# EAGLE design perfboard-tiny45usb2 (EAGLE 5.06)
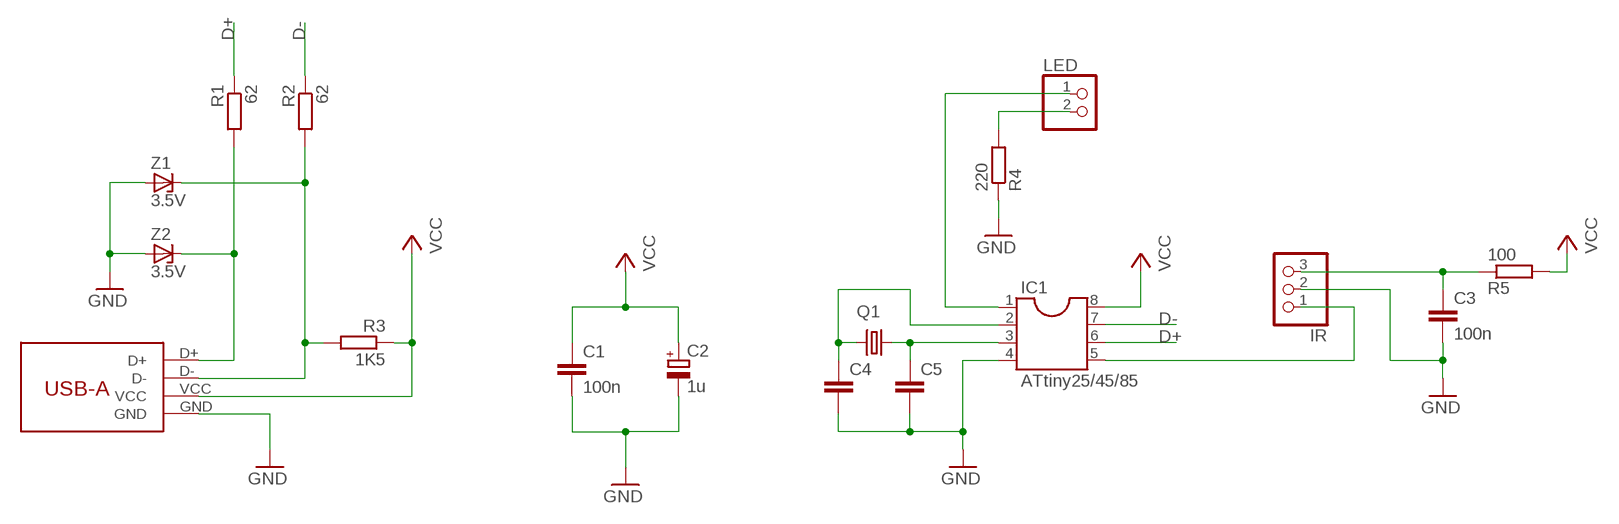
[diagram p0: schematic, sheet 1]

## Parts
C1  100n  C-EU025-024X044  [C025-024X044]
C2  1u  CPOL-EUE2,5-6E  [E2,5-6E]
C3  100n  C-EU025-024X044  [C025-024X044]
C4  C-EU050-030X075  [C050-030X075]
C5  C-EU075-032X103  [C075-032X103]
IC1  ATtiny25/45/85  DIL8  [DIL08]
IR  PINHD-1X3  [1X03]
LED  PINHD-1X2  [1X02]
Q1  CRYSTALHC49S  [HC49/S]
R1  62  R-EU_0204/2V  [0204V]
R2  62  R-EU_0204/2V  [0204V]
R3  1K5  R-EU_0207/2V  [0207/2V]
R4  220  R-EU_0207/5V  [0207/5V]
R5  100  R-EU_0204/7  [0204/7]
U$2  USB-A  [DIP]
Z1  3.5V  ZENER-DIODEZD-10  [ZDIO-10]
Z2  3.5V  ZENER-DIODEZD-7.5  [ZDIO-7.5]

## Nets
D+: IC1.6 R1.1
D-: IC1.7 R2.1
GND: C1.2 C2.- C3.2 C4.2 C5.2 IC1.4 IR.2 R4.1 U$2.GND Z1.A Z2.A
LED: IC1.1 LED.1
N$1: R1.2 U$2.D+ Z2.C
N$2: R2.2 R3.2 U$2.D- Z1.C
N$3: C5.1 IC1.3 Q1.1
N$4: C4.1 IC1.2 Q1.2
N$5: IC1.5 IR.1
N$6: LED.2 R4.2
N$7: C3.1 IR.3 R5.1
VCC: C1.1 C2.+ IC1.8 R3.1 R5.2 U$2.VCC

## Library data of the parts
C1 C3-C5 = rcl:C-EU: CAPACITOR, European symbol
C2 = rcl:CPOL-EU: POLARIZED CAPACITOR, European symbol
IC1 = ic-package:DIL8: Dual In Line / Socket
IR = pinhead:PINHD-1X3: PIN HEADER
LED = pinhead:PINHD-1X2: PIN HEADER
Q1 = crystal:CRYSTAL: CRYSTAL
R1-R5 = rcl:R-EU_: RESISTOR, European symbol
U$2 = assmann-usb-a-dip:USB-A
Z1 Z2 = diode:ZENER-DIODE: Z-Diode

## Board
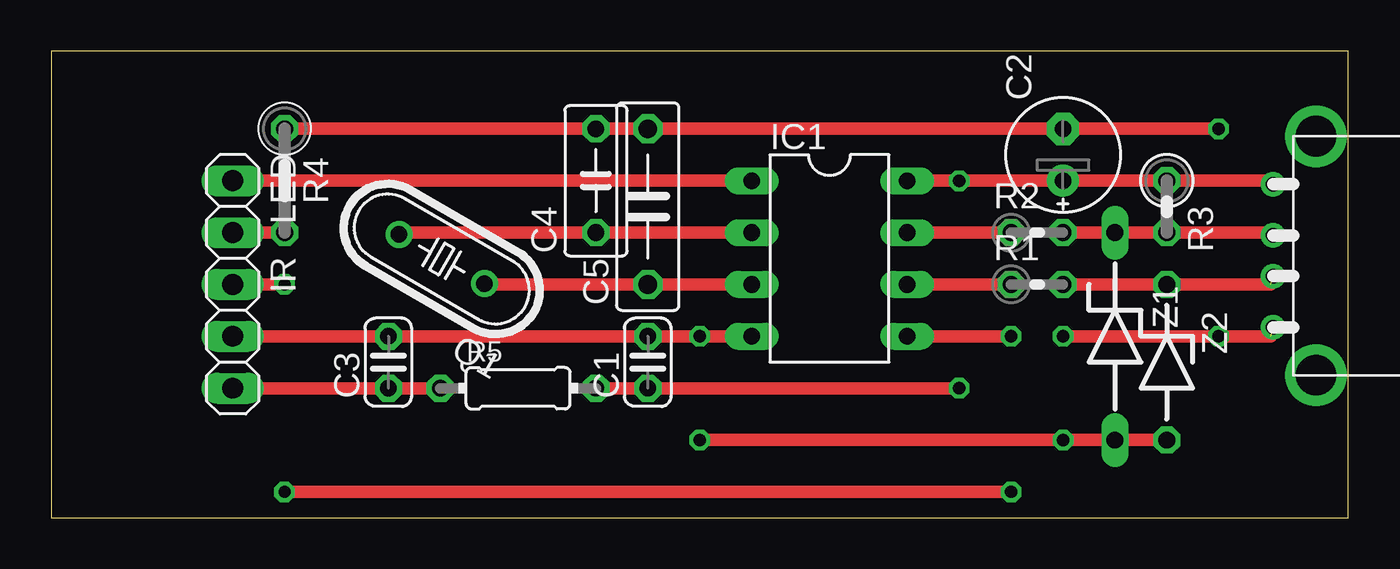
[diagram p1: board, top side]
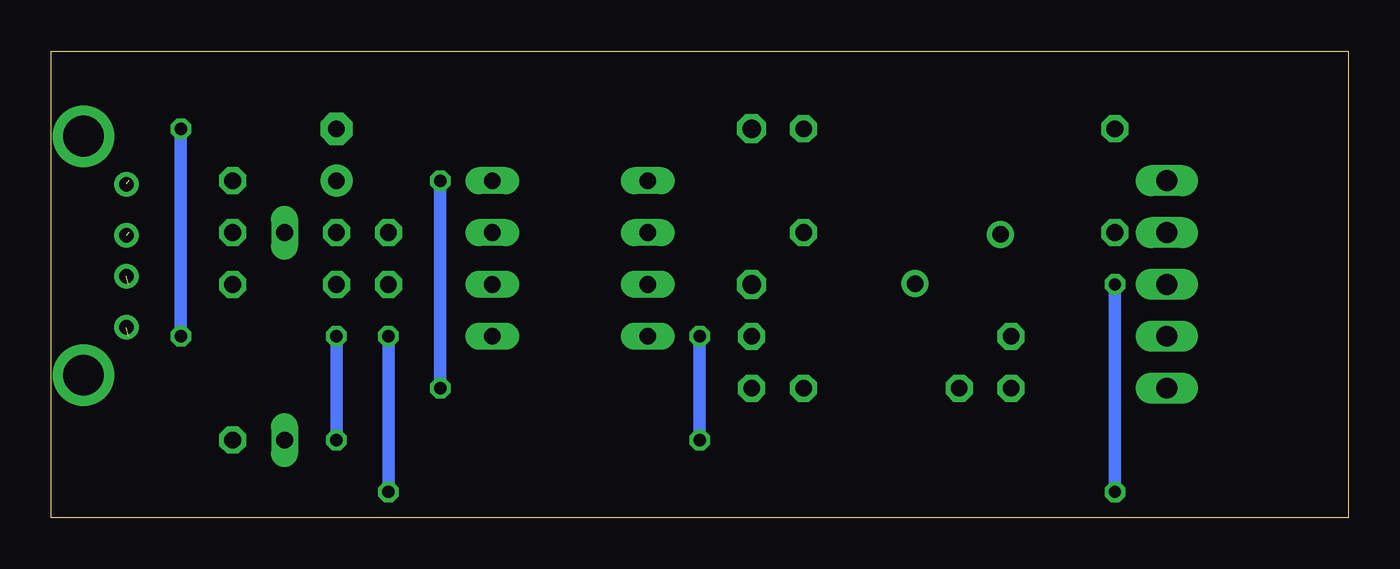
[diagram p2: board, bottom side, seen from below]

Size 63.5 x 22.86 mm. Coordinates in mm from the lower left corner, seen from the top.
Outline: 0,0 63.5,0 63.5,22.86 0,22.86 0,0
Copper layers (1*16): Top 0.035mm / dielectric 1.5mm / Bottom 0.035mm
Design rules "default": minimum track width 10mil, minimum drill 24mil, track to track 8mil, track to pad 8mil, pad to pad 8mil, via to via 8mil, smd to smd 8mil, copper to edge 40mil, drill to drill 8mil, minimum pad ring 10mil, minimum via ring 8mil, stop-mask expansion 4mil, vias tented up to drill 0mil, thermal gap 10mil

### Footprints (pad centres in the part's own frame; a part is rotated, then mirrored left to right if it is on the bottom)
C025-024X044 = drill 0.813 octagon: 1 -1.27,0; 2 1.27,0
E2,5-6E = drill 0.813 pad 1.575 round: + -1.27,0 | drill 0.813 pad 1.575 octagon: - 1.27,0
C050-030X075 = drill 0.813 octagon: 1 -2.54,0; 2 2.54,0
C075-032X103 = drill 0.914 octagon: 1 -3.81,0; 2 3.81,0
DIL08 = drill 0.813 long: 1 -3.81,-3.81; 2 -1.27,-3.81; 3 1.27,-3.81; 4 3.81,-3.81; 5 3.81,3.81; 6 1.27,3.81; 7 -1.27,3.81; 8 -3.81,3.81
1X03 = drill 1.016 long: 1 -2.54,0; 2 0,0; 3 2.54,0
1X02 = drill 1.016 long: 1 -1.27,0; 2 1.27,0
HC49/S = drill 0.813 round: 1 -2.413,0; 2 2.413,0
0204V = drill 0.813 octagon: 1 -1.27,0; 2 1.27,0
0207/2V = drill 0.813 octagon: 1 -1.27,0; 2 1.27,0
0207/5V = drill 0.813 octagon: 1 -2.54,0; 2 2.54,0
0204/7 = drill 0.813 octagon: 1 -3.81,0; 2 3.81,0
DIP = drill 0.7 round: D+ 4.85,2.1; D- 6.85,2.1; GND 2.35,2.1; VCC 9.35,2.1 | drill 2 round: P$1 0,0; P$2 11.7,0
ZDIO-10 = drill 0.813 long: A 5.08,0; C -5.08,0
ZDIO-7.5 = drill 0.813 octagon: A 3.81,0; C -3.81,0

### Placement (x,y rotation side)
C1  29.21,7.62 90 top
C2  49.53,17.78 90 top
C3  16.51,7.62 90 top
C4  26.67,16.51 90 top
C5  29.21,15.24 90 top
IC1  38.1,12.7 270 top
IR  8.89,8.89 270 top
LED  8.89,15.24 270 top
Q1  19.12,12.68 150 top
R1  48.26,11.43 0 top
R2  48.26,13.97 0 top
R3  54.61,15.24 270 top
R4  11.43,16.51 270 top
R5  22.86,6.35 0 top
U$2  61.91,6.98 90 top
Z1  52.07,8.89 270 top
Z2  54.61,7.62 270 top

### Tracks (layer width: path | path; a pad name or v marks a point on that pad's centre or on a via)
D+
  Top 0.61: IC1.6 R1.1
D-
  Top 0.61: IC1.7 R2.1
GND  (via drill 0.6)  (1 unrouted)
  Top 0.61: v57.15,19.05 C2.- C5.2 C4.2 R4.1 | v49.53,8.89 v57.15,8.89 59.69,8.89 | Z2.A Z1.A v49.53,3.81 v31.75,3.81 | IC1.4 v31.75,8.89 C1.2 C3.2 IR.2
  Bottom 0.61: v57.15,8.89 v57.15,19.05 | v49.53,3.81 v49.53,8.89 | v31.75,8.89 v31.75,3.81
LED
  Top 0.61: LED.1 IC1.1
N$1  (1 unrouted)
  Top 0.61: R1.2 Z2.C 59.69,11.43
N$2  (1 unrouted)
  Top 0.61: R2.2 Z1.C R3.2 59.69,13.97
N$3
  Top 0.61: IC1.3 C5.1 21.21,11.43 Q1.1
N$4
  Top 0.61: IC1.2 C4.1 17.03,13.97 Q1.2
N$5  (via drill 0.6)
  Top 0.61: v11.43,11.43 IR.1 | v11.43,1.27 v46.99,1.27 | v46.99,8.89 IC1.5
  Bottom 0.61: v11.43,1.27 v11.43,11.43 | v46.99,1.27 v46.99,8.89
N$6
  Top 0.61: R4.2 LED.2
N$7
  Top 0.61: IR.3 C3.1 R5.1
VCC  (via drill 0.6)  (1 unrouted)
  Top 0.61: 59.69,16.51 R3.1 C2.+ v44.45,16.51 IC1.8 | v44.45,6.35 C1.1 R5.2
  Bottom 0.61: v44.45,6.35 v44.45,16.51

### Text on the board
Document: LED | + | - | TSOP | s | - | +